# Altium schematic sheet Racer_Top_Level.SchDoc
size A3; Address1: ECE Department; Address2: University of Canterbury; Address3: Christchurch 8041; Address4: New Zealand; Revision: 1
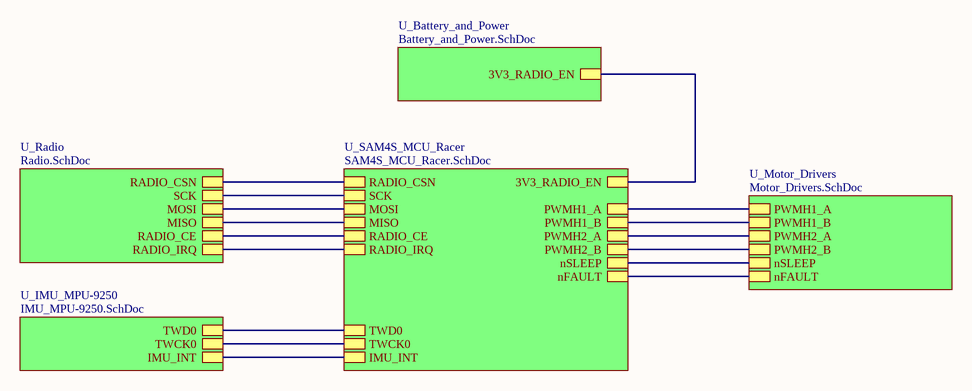
[diagram p0: Racer_Top_Level.SchDoc]

## Sub-sheets
U_Battery_and_Power = Battery_and_Power.SchDoc: 3V3_RADIO_EN
U_IMU_MPU-9250 = IMU_MPU-9250.SchDoc: TWD0, TWCK0, IMU_INT
U_Motor_Drivers = Motor_Drivers.SchDoc: PWMH1_A, PWMH1_B, PWMH2_A, PWMH2_B, nSLEEP, nFAULT
U_Radio = Radio.SchDoc: RADIO_CSN, SCK, MOSI, MISO, RADIO_CE, RADIO_IRQ
U_SAM4S_MCU_Racer = SAM4S_MCU_Racer.SchDoc: MISO, MOSI, SCK, RADIO_IRQ, PWMH1_A, PWMH1_B, PWMH2_A, PWMH2_B, nSLEEP, nFAULT, RADIO_CE, RADIO_CSN, 3V3_RADIO_EN, TWD0, TWCK0, IMU_INT

## Nets
(unnamed): sheet U_Battery_and_Power/3V3_RADIO_EN, sheet U_SAM4S_MCU_Racer/3V3_RADIO_EN
(unnamed): sheet U_Motor_Drivers/PWMH1_A, sheet U_SAM4S_MCU_Racer/PWMH1_A
(unnamed): sheet U_Motor_Drivers/PWMH1_B, sheet U_SAM4S_MCU_Racer/PWMH1_B
(unnamed): sheet U_Motor_Drivers/PWMH2_A, sheet U_SAM4S_MCU_Racer/PWMH2_A
(unnamed): sheet U_Motor_Drivers/PWMH2_B, sheet U_SAM4S_MCU_Racer/PWMH2_B
(unnamed): sheet U_Motor_Drivers/nSLEEP, sheet U_SAM4S_MCU_Racer/nSLEEP
(unnamed): sheet U_Motor_Drivers/nFAULT, sheet U_SAM4S_MCU_Racer/nFAULT
(unnamed): sheet U_Radio/RADIO_CSN, sheet U_SAM4S_MCU_Racer/RADIO_CSN
(unnamed): sheet U_Radio/SCK, sheet U_SAM4S_MCU_Racer/SCK
(unnamed): sheet U_Radio/MOSI, sheet U_SAM4S_MCU_Racer/MOSI
(unnamed): sheet U_Radio/MISO, sheet U_SAM4S_MCU_Racer/MISO
(unnamed): sheet U_Radio/RADIO_CE, sheet U_SAM4S_MCU_Racer/RADIO_CE
(unnamed): sheet U_Radio/RADIO_IRQ, sheet U_SAM4S_MCU_Racer/RADIO_IRQ
(unnamed): sheet U_SAM4S_MCU_Racer/TWD0, sheet U_IMU_MPU-9250/TWD0
(unnamed): sheet U_SAM4S_MCU_Racer/TWCK0, sheet U_IMU_MPU-9250/TWCK0
(unnamed): sheet U_SAM4S_MCU_Racer/IMU_INT, sheet U_IMU_MPU-9250/IMU_INT

## Notes on the sheet
- Title
- Drawn by:
- Date:
- Time:
- Revision:
- Sheet
- of
- File: